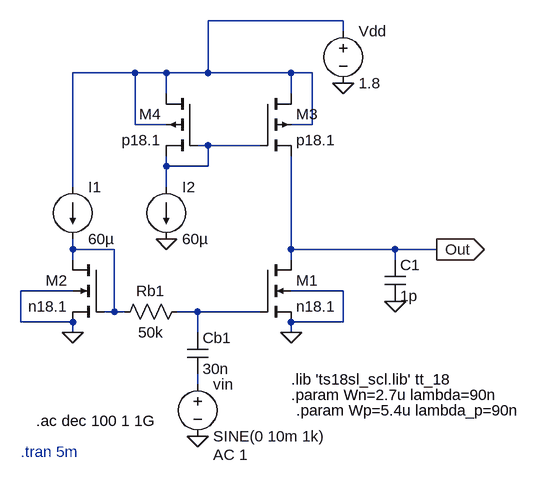
[diagram p0: schematic q4_2.asc]
q4_2.asc, the LTspice schematic file:
Version 4.1
SHEET 1 880 680
WIRE 368 -240 160 -240
WIRE 368 -224 368 -240
WIRE 48 -160 -48 -160
WIRE 96 -160 48 -160
WIRE 160 -160 160 -240
WIRE 160 -160 96 -160
WIRE 288 -160 160 -160
WIRE 320 -160 288 -160
WIRE 96 -128 96 -160
WIRE 288 -128 288 -160
WIRE 48 -80 48 -160
WIRE 96 -80 48 -80
WIRE 320 -80 320 -160
WIRE 320 -80 288 -80
WIRE 160 -48 144 -48
WIRE 240 -48 160 -48
WIRE 96 -16 96 -32
WIRE 160 -16 160 -48
WIRE 160 -16 96 -16
WIRE -48 16 -48 -160
WIRE 96 16 96 -16
WIRE -48 112 -48 96
WIRE 16 112 -48 112
WIRE 288 112 288 -32
WIRE 448 112 288 112
WIRE 512 112 448 112
WIRE -48 128 -48 112
WIRE 288 128 288 112
WIRE 448 128 448 112
WIRE -48 176 -128 176
WIRE 368 176 288 176
WIRE 16 208 16 112
WIRE 16 208 0 208
WIRE 32 208 16 208
WIRE 144 208 112 208
WIRE 240 208 144 208
WIRE -128 224 -128 176
WIRE -48 224 -128 224
WIRE 368 224 368 176
WIRE 368 224 288 224
WIRE -48 240 -48 224
WIRE 144 240 144 208
WIRE 288 240 288 224
WIRE 144 320 144 304
FLAG 368 -144 0
FLAG 288 240 0
FLAG 144 400 0
FLAG -48 240 0
FLAG 512 112 Out
IOPIN 512 112 Out
FLAG 96 96 0
FLAG 448 192 0
SYMBOL voltage 368 -240 R0
WINDOW 123 0 0 Left 0
WINDOW 39 0 0 Left 0
SYMATTR InstName Vdd
SYMATTR Value 1.8
SYMBOL nmos4 240 128 R0
SYMATTR InstName M1
SYMATTR Value n18.1
SYMATTR Value2 l={2*lambda} w={Wn} ad={5*lambda*Wn} as={5*lambda*Wn} pd={2*Wn + 10*lambda} ps={2*Wn + 10*lambda}
SYMBOL cap 128 240 R0
SYMATTR InstName Cb1
SYMATTR Value 30n
SYMBOL voltage 144 304 R0
WINDOW 123 24 124 Left 2
WINDOW 39 0 0 Left 0
SYMATTR Value2 AC 1
SYMATTR InstName vin
SYMATTR Value SINE(0 10m 1k)
SYMBOL res 128 192 R90
WINDOW 0 0 56 VBottom 2
WINDOW 3 32 56 VTop 2
SYMATTR InstName Rb1
SYMATTR Value 50k
SYMBOL nmos4 0 128 M0
SYMATTR InstName M2
SYMATTR Value n18.1
SYMATTR Value2 l={2*lambda} w={Wn} ad={5*lambda*Wn} as={5*lambda*Wn} pd={2*Wn + 10*lambda} ps={2*Wn + 10*lambda}
SYMBOL current -48 16 R0
WINDOW 123 0 0 Left 0
WINDOW 39 0 0 Left 0
SYMATTR InstName I1
SYMATTR Value 60µ
SYMBOL pmos4 240 -128 R0
SYMATTR InstName M3
SYMATTR Value p18.1
SYMATTR Value2 l={2*lambda_p} w={Wp} ad={5*lambda_p*Wp} as={5*lambda_p*Wp} pd={2*Wp + 10*lambda_p} ps={2*Wp + 10*lambda_p}
SYMBOL current 96 16 R0
WINDOW 123 0 0 Left 0
WINDOW 39 0 0 Left 0
SYMATTR InstName I2
SYMATTR Value 60µ
SYMBOL pmos4 144 -128 M0
SYMATTR InstName M4
SYMATTR Value p18.1
SYMATTR Value2 l={2*lambda_p} w={Wp} ad={5*lambda_p*Wp} as={5*lambda_p*Wp} pd={2*Wp + 10*lambda_p} ps={2*Wp + 10*lambda_p}
SYMBOL cap 432 128 R0
SYMATTR InstName C1
SYMATTR Value 1p
TEXT 288 336 Left 2 !.param Wn=2.7u lambda=90n
TEXT 288 312 Left 2 !.lib 'ts18sl_scl.lib' tt_18
TEXT -128 424 Left 2 ;.tran 5m
TEXT -104 376 Left 2 !.ac dec 100 1 1G
TEXT 296 360 Left 2 !.param Wp=5.4u lambda_p=90n

The netlist it stands for:
* q4_2.asc
Vdd N001 0 1.8
M1 Out N004 0 0 n18.1 l={2*lambda} w={Wn} ad={5*lambda*Wn} as={5*lambda*Wn} pd={2*Wn + 10*lambda} ps={2*Wn + 10*lambda}
Cb1 N004 N005 30n
vin N005 0 SINE(0 10m 1k) AC 1
Rb1 N004 N003 50k
M2 N003 N003 0 0 n18.1 l={2*lambda} w={Wn} ad={5*lambda*Wn} as={5*lambda*Wn} pd={2*Wn + 10*lambda} ps={2*Wn + 10*lambda}
I1 N001 N003 60µ
M3 N001 N002 Out N001 p18.1 l={2*lambda_p} w={Wp} ad={5*lambda_p*Wp} as={5*lambda_p*Wp} pd={2*Wp + 10*lambda_p} ps={2*Wp + 10*lambda_p}
I2 N002 0 60µ
M4 N001 N002 N002 N001 p18.1 l={2*lambda_p} w={Wp} ad={5*lambda_p*Wp} as={5*lambda_p*Wp} pd={2*Wp + 10*lambda_p} ps={2*Wp + 10*lambda_p}
C1 Out 0 1p
.model NMOS NMOS
.model PMOS PMOS
.lib standard.mos
.param Wn=2.7u lambda=90n
.lib 'ts18sl_scl.lib' tt_18
* .tran 5m
.ac dec 100 1 1G
.param Wp=5.4u lambda_p=90n
.backanno
.end